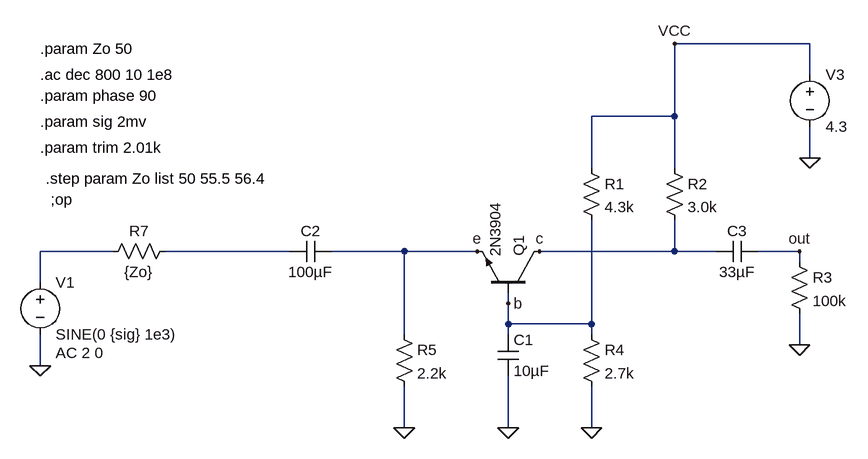
[diagram p0: schematic CB-Isolation-Amp-Zin.asc]
CB-Isolation-Amp-Zin.asc, the LTspice schematic file:
Version 4
SHEET 1 880 680
WIRE 656 -144 448 -144
WIRE 656 -96 656 -144
WIRE 448 -32 448 -144
WIRE 448 -32 320 -32
WIRE 656 32 656 -16
WIRE 320 48 320 -32
WIRE 448 48 448 -32
WIRE -416 176 -528 176
WIRE -144 176 -336 176
WIRE 32 176 -80 176
WIRE 144 176 32 176
WIRE 448 176 448 128
WIRE 448 176 240 176
WIRE 512 176 448 176
WIRE 640 176 576 176
WIRE 640 192 640 176
WIRE -528 224 -528 176
WIRE 192 256 192 240
WIRE 192 288 192 256
WIRE 320 288 320 128
WIRE 320 288 192 288
WIRE 32 304 32 176
WIRE 192 304 192 288
WIRE 320 304 320 288
WIRE 640 320 640 272
WIRE -528 352 -528 304
WIRE 32 448 32 384
WIRE 192 448 192 368
WIRE 320 448 320 384
FLAG -528 352 0
FLAG 32 448 0
FLAG 192 448 0
FLAG 320 448 0
FLAG 640 320 0
FLAG 656 32 0
FLAG 640 176 out
FLAG 240 176 c
FLAG 144 176 e
FLAG 192 256 b
FLAG 448 -144 VCC
SYMBOL npn 240 240 M270
SYMATTR InstName Q1
SYMATTR Value 2N3904
SYMBOL res 304 32 R0
SYMATTR InstName R1
SYMATTR Value 4.3k
SYMBOL res 432 32 R0
SYMATTR InstName R2
SYMATTR Value 3.0k
SYMBOL res 624 176 R0
SYMATTR InstName R3
SYMATTR Value 100k
SYMBOL res 304 288 R0
SYMATTR InstName R4
SYMATTR Value 2.7k
SYMBOL res 16 288 R0
SYMATTR InstName R5
SYMATTR Value 2.2k
SYMBOL res -320 160 R90
WINDOW 0 0 56 VBottom 2
WINDOW 3 32 56 VTop 2
SYMATTR InstName R7
SYMATTR Value {Zo}
SYMBOL voltage -528 208 R0
WINDOW 123 24 124 Left 2
WINDOW 39 0 0 Left 0
SYMATTR InstName V1
SYMATTR Value SINE(0 {sig} 1e3)
SYMATTR Value2 AC 2 0
SYMBOL voltage 656 -112 R0
SYMATTR InstName V3
SYMATTR Value 4.3
SYMBOL cap 176 304 R0
SYMATTR InstName C1
SYMATTR Value 10µF
SYMBOL cap -80 160 R90
WINDOW 0 0 32 VBottom 2
WINDOW 3 32 32 VTop 2
SYMATTR InstName C2
SYMATTR Value 100µF
SYMBOL cap 576 160 R90
WINDOW 0 0 32 VBottom 2
WINDOW 3 32 32 VTop 2
SYMATTR InstName C3
SYMATTR Value 33µF
TEXT -528 -136 Left 2 !.param Zo 50
TEXT -528 -96 Left 2 !.ac dec 800 10 1e8
TEXT -528 -64 Left 2 !.param phase 90
TEXT -528 -24 Left 2 !.param sig 2mv
TEXT -528 16 Left 2 !.param trim 2.01k
TEXT -512 96 Left 2 !;op
TEXT -520 64 Left 2 !.step param Zo list 50 55.5 56.4

The netlist it stands for:
* CB-Isolation-Amp-Zin.asc
Q1 c b e 0 2N3904
R1 VCC b 4.3k
R2 VCC c 3.0k
R3 out 0 100k
R4 b 0 2.7k
R5 e 0 2.2k
R7 N002 N001 {Zo}
V1 N001 0 SINE(0 {sig} 1e3) AC 2 0
V3 VCC 0 4.3
C1 b 0 10µF
C2 e N002 100µF
C3 out c 33µF
.model NPN NPN
.model PNP PNP
.lib standard.bjt
.param Zo 50
.ac dec 800 10 1e8
.param phase 90
.param sig 2mv
.param trim 2.01k
;op
.step param Zo list 50 55.5 56.4
.backanno
.end

* Results of the author's LTspice run, read from the files saved beside the schematic
* Operating Point (first step), zero values left out:
*   zo = 50 
*   V(c) = 2.912 V
*   V(b) = 1.656 V
*   V(e) = 1.021 V
*   V(vcc) = 4.3 V
*   Ic(Q1) = 462.6 µA
*   Ib(Q1) = 1.525 µA
*   Ie(Q1) = -464.1 µA
*   I(R5) = 464.1 µA
*   I(R4) = 613.3 µA
*   I(R2) = 462.6 µA
*   I(R1) = 614.9 µA
*   I(V3) = -1.077 mA